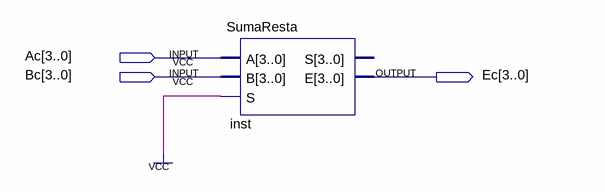
[diagram p0: schematic sheet]
// Quartus schematic Cmp4bits.bdf as structural Verilog: 1 symbols, 3 pins
module Cmp4bits (
  input  [3:0] Ac,
  input  [3:0] Bc,
  output [3:0] Ec
);
  wire [3:0] inst_s_open;  // unused outputs

  SumaResta inst (.A(Ac), .B(Bc), .S({inst_s_open[3:1], 1'b1, inst_s_open[0]}), .E(Ec));
endmodule
